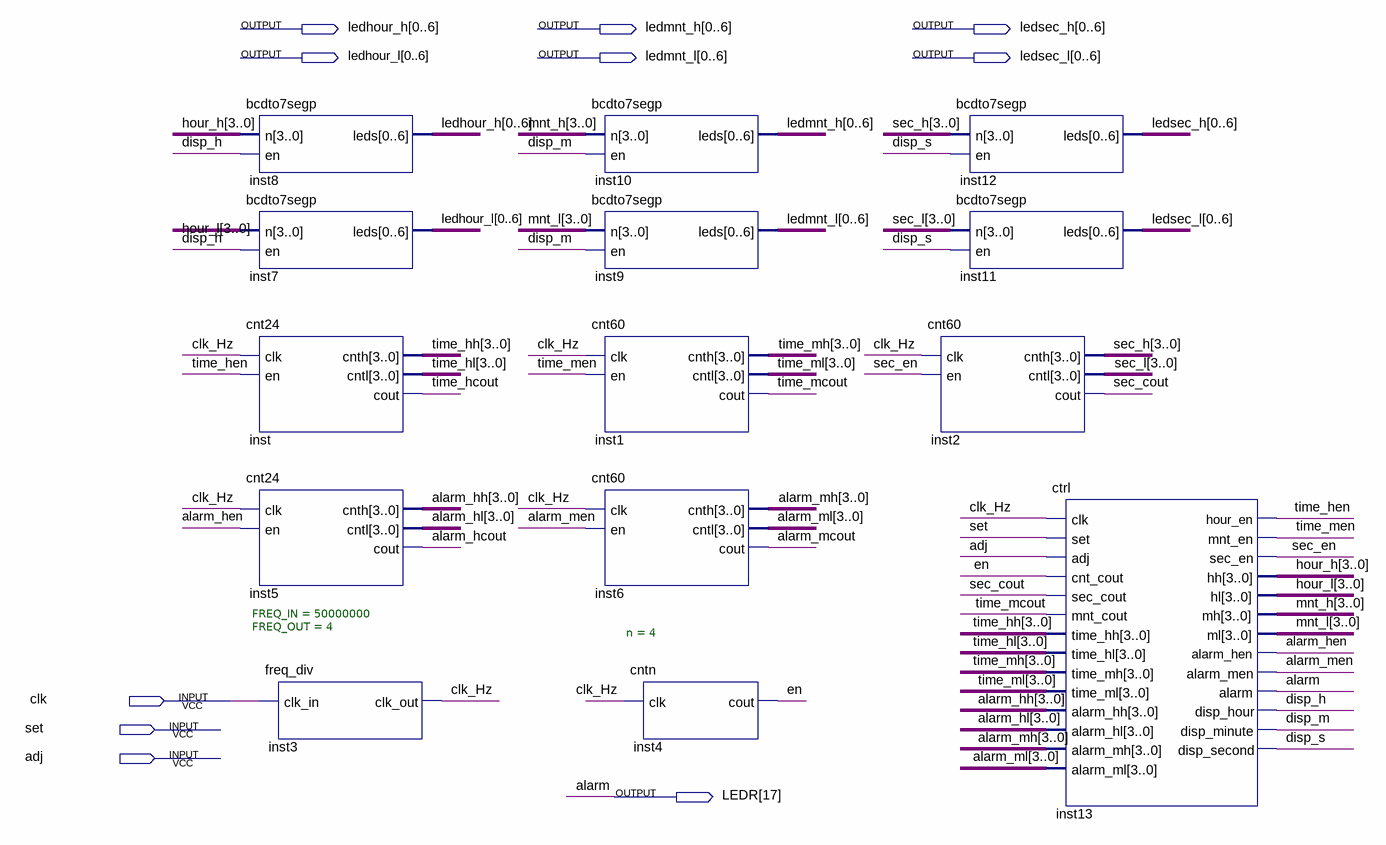
[diagram p0: schematic sheet]
// Quartus schematic DigitalClock2.bdf as structural Verilog: 14 symbols, 10 pins
module DigitalClock2 (
  input  clk,
  input  set,
  input  adj,
  output [0:6] ledhour_h,
  output [0:6] ledmnt_h,
  output [0:6] ledsec_h,
  output [0:6] ledhour_l,
  output [0:6] ledmnt_l,
  output [0:6] ledsec_l,
  output [17:17] LEDR
);

  wire alarm_hcout, alarm_hen, alarm_mcout, alarm_men, clk_Hz, disp_h, disp_m, disp_s, en, sec_cout, sec_en,
       time_hcout, time_hen, time_mcout, time_men;
  wire [3:0] alarm_hh, alarm_hl, alarm_mh, alarm_ml, hour_h, hour_l, mnt_h, mnt_l, sec_h, sec_l, time_hh,
       time_hl, time_mh, time_ml;

  bcdto7segp inst8 (.n(hour_h), .en(disp_h), .leds(ledhour_h));
  bcdto7segp inst7 (.n(hour_l), .en(disp_h), .leds(ledhour_l));
  cnt24 inst (.clk(clk_Hz), .en(time_hen), .cnth(time_hh), .cntl(time_hl), .cout(time_hcout));
  cnt24 inst5 (.clk(clk_Hz), .en(alarm_hen), .cnth(alarm_hh), .cntl(alarm_hl), .cout(alarm_hcout));
  freq_div #(.FREQ_IN(50000000), .FREQ_OUT(4)) inst3 (.clk_in(clk), .clk_out(clk_Hz));
  bcdto7segp inst10 (.n(mnt_h), .en(disp_m), .leds(ledmnt_h));
  bcdto7segp inst9 (.n(mnt_l), .en(disp_m), .leds(ledmnt_l));
  cnt60 inst1 (.clk(clk_Hz), .en(time_men), .cnth(time_mh), .cntl(time_ml), .cout(time_mcout));
  cnt60 inst6 (.clk(clk_Hz), .en(alarm_men), .cnth(alarm_mh), .cntl(alarm_ml), .cout(alarm_mcout));
  cntn #(.n(4)) inst4 (.clk(clk_Hz), .cout(en));
  bcdto7segp inst12 (.n(sec_h), .en(disp_s), .leds(ledsec_h));
  bcdto7segp inst11 (.n(sec_l), .en(disp_s), .leds(ledsec_l));
  cnt60 inst2 (.clk(clk_Hz), .en(sec_en), .cnth(sec_h), .cntl(sec_l), .cout(sec_cout));
  ctrl inst13 (
    .clk(clk_Hz), .set(set), .adj(adj), .cnt_cout(en), .sec_cout(sec_cout), .mnt_cout(time_mcout),
    .time_hh(time_hh), .time_hl(time_hl), .time_mh(time_mh), .time_ml(time_ml), .alarm_hh(alarm_hh),
    .alarm_hl(alarm_hl), .alarm_mh(alarm_mh), .alarm_ml(alarm_ml), .hour_en(time_hen), .mnt_en(time_men),
    .sec_en(sec_en), .hh(hour_h), .hl(hour_l), .mh(mnt_h), .ml(mnt_l), .alarm_hen(alarm_hen),
    .alarm_men(alarm_men), .alarm(LEDR[17]), .disp_hour(disp_h), .disp_minute(disp_m), .disp_second(disp_s));

  // Other names for the same wires on the sheet: alarm = LEDR[17]
endmodule
